# EAGLE design OpenROV Light Board 2.7A (EAGLE 6.4)
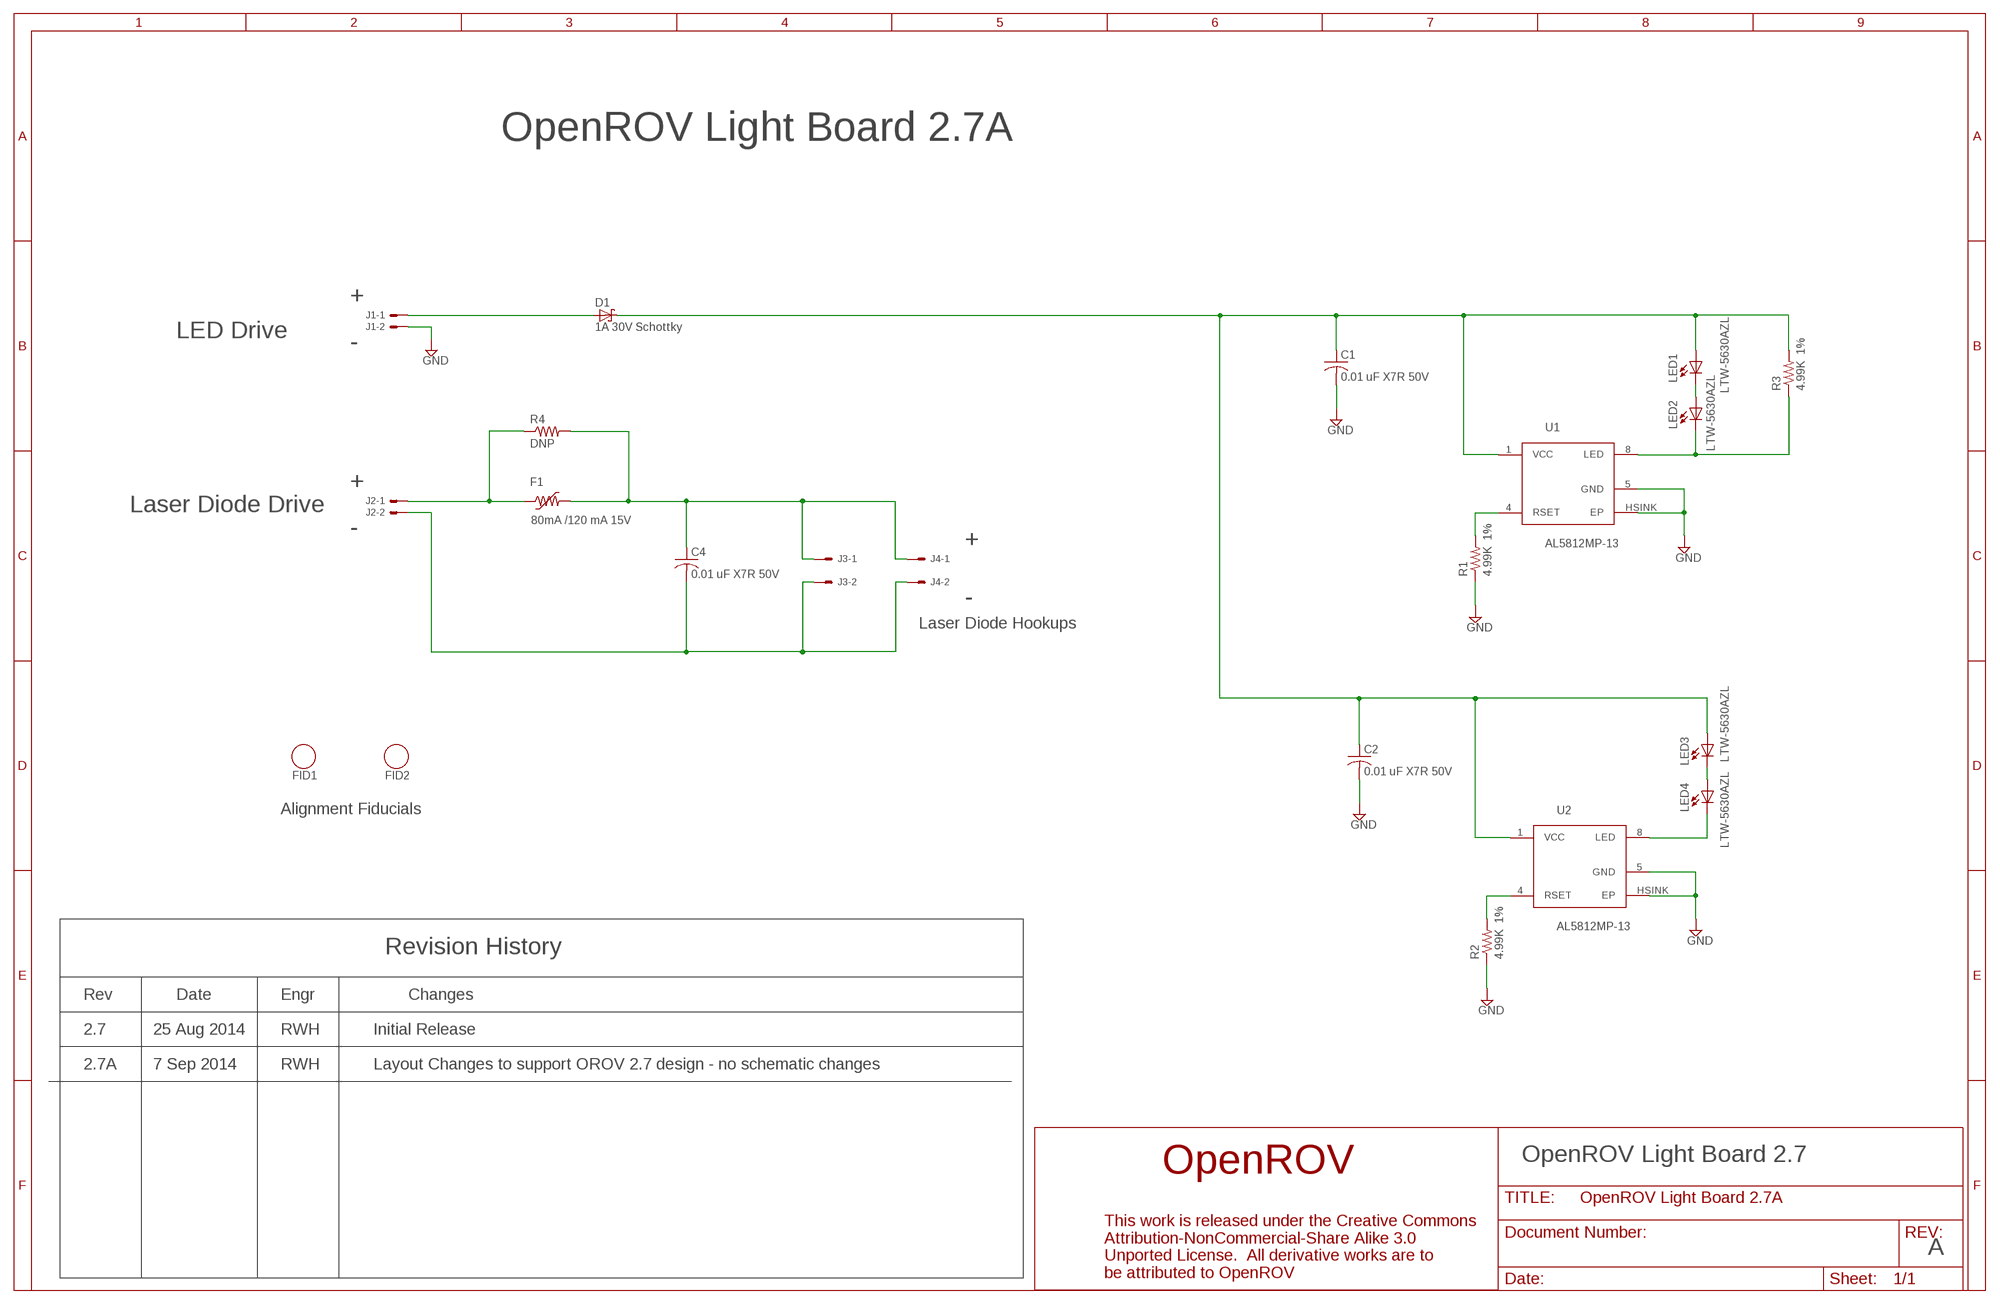
[diagram p0: schematic, sheet 1]

## Parts
C1  0.01 uF X7R 50V  CAP0603  [R0603]
C2  0.01 uF X7R 50V  CAP0603  [R0603]
C4  0.01 uF X7R 50V  CAP0603  [R0603]
D1  1A 30V Schottky  SCHOTTKYDO214AC  [DO214AC]
F1  80mA /120 mA 15V  POLYFUSE-0603  [R0603]
FID1  FIDUCIAL_1  [FIDUCIAL_1]
FID2  FIDUCIAL_1  [FIDUCIAL_1]
J1  HDR_1X2X0.100-ALT_SILK  [22-23-2021_ALT_SILK]
J2  HDR_1X2X0.100-ALT_SILK  [22-23-2021_ALT_SILK]
J3  HDR_1X2X2MM  [87758-0216]
J4  HDR_1X2X2MM  [87758-0216]
LED1  LTW-5630AZL  [LITEON-5630]
LED2  LTW-5630AZL  [LITEON-5630]
LED3  LTW-5630AZL  [LITEON-5630]
LED4  LTW-5630AZL  [LITEON-5630]
R1  4.99K 1%  RESISTOR-0603  [R0603]
R2  4.99K 1%  RESISTOR-0603  [R0603]
R3  4.99K 1%  RESISTOR-0603  [R0603]
R4  DNP  RESISTOR-1206  [R1206]
U1  AL5812MP-13  [MSOP-8EP]
U2  AL5812MP-13  [MSOP-8EP]

## Nets
GND: C1.2 C2.2 J1.2 R1.1 R2.1 U1.5(GND) U1.HSINK(EP) U2.5(GND) U2.HSINK(EP)
N$1: LED2.C1(C) LED2.C2(C) R3.1 U1.8(LED)
N$2: LED1.C1(C) LED1.C2(C) LED2.A1(A) LED2.A2(A) LED2.A3(A)
N$3: C4.1 F1.2 J3.1 J4.1 R4.2
N$4: C4.2 J2.2 J3.2 J4.2
N$5: F1.1 J2.1 R4.1
N$6: R1.2 U1.4(RSET)
N$7: LED4.C1(C) LED4.C2(C) U2.8(LED)
N$8: LED3.C1(C) LED3.C2(C) LED4.A1(A) LED4.A2(A) LED4.A3(A)
N$9: C1.1 C2.1 D1.C LED1.A1(A) LED1.A2(A) LED1.A3(A) LED3.A1(A) LED3.A2(A) LED3.A3(A) R3.2 U1.1(VCC) U2.1(VCC)
N$11: D1.A J1.1
N$13: R2.2 U2.4(RSET)

## Notes on the sheet
- OpenROV Light Board 2.7A
- +
- LED Drive
- -
- +
- Laser Diode Drive
- -
- +
- -
- Laser Diode Hookups
- Alignment Fiducials
- Revision History
- Rev | Date | Engr | Changes
- 2.7 | 25 Aug 2014 | RWH | Initial Release
- 2.7A | 7 Sep 2014 | RWH | Layout Changes to support OROV 2.7 design - no schematic changes
- OpenROV Light Board 2.7
- A

## Library data of the parts
C1 C2 C4 = Walts_Generic_Parts:CAP: Generic Non-Polarized Capacitor
D1 = Walts_Generic_Parts:SCHOTTKY: Silicon Schottky Diodes
F1 = Walts_Generic_Parts:POLYFUSE: Polyfuse / PPTC
FID1 FID2 = Walts Test Points and Pads:FIDUCIAL_1: Alignment Fiducial
J1 J2 = Walts Generic Connectors:HDR_1X2X0.100: .100" (2.54mm) Center Header - 2 Pin Derived from Molex 22-23-2021
J3 J4 = Walts Generic Connectors:HDR_1X2X2MM: Original Source: Eagle Lib con-molex/87758-0216 2 Pin - 2mm Dual Row Single Wafer, Vertical T/H HDR Source: http://www.molex.com/pdm_docs/sd/877580616_sd.pdf; MPN: 87758-0216; OC_FARNELL: unknown; OC_NEWARK: 94M1513
LED1-LED4 = OpenROV LED Library:LTW-5630AZL: Lite-On 5x3 mm LTW-5630AZL White LED
R1-R4 = Walts_Generic_Parts:RESISTOR: Generic Resistor
U1 U2 = OpenROV LED Library:AL5812: Diodes, Inc AL5812 LED Driver

## Board
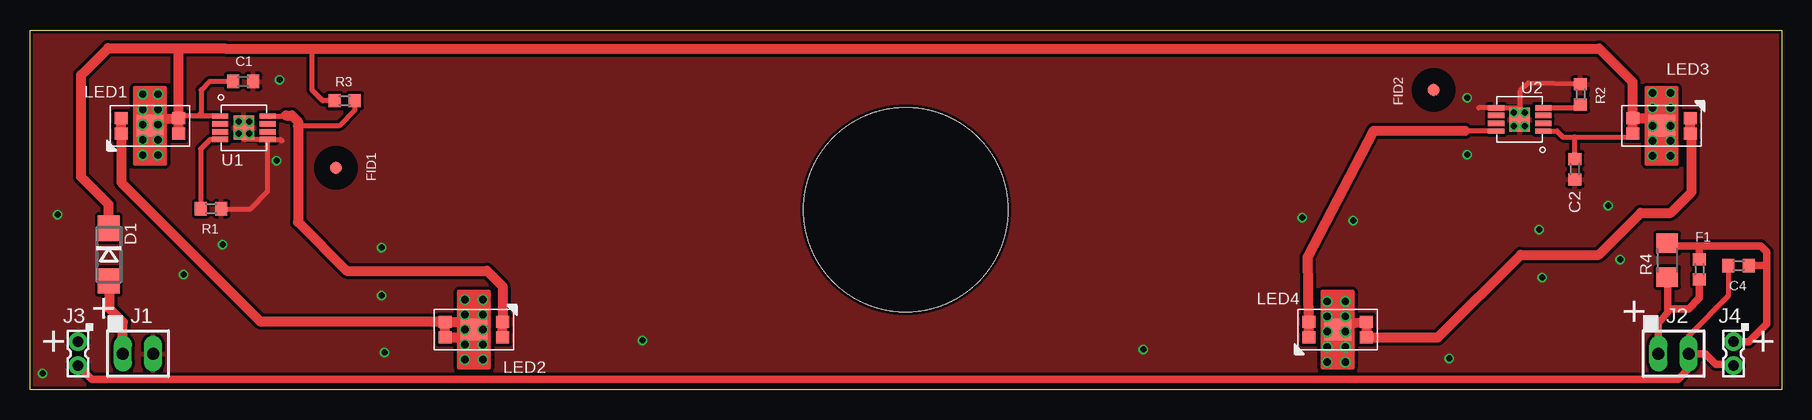
[diagram p1: board, top side]
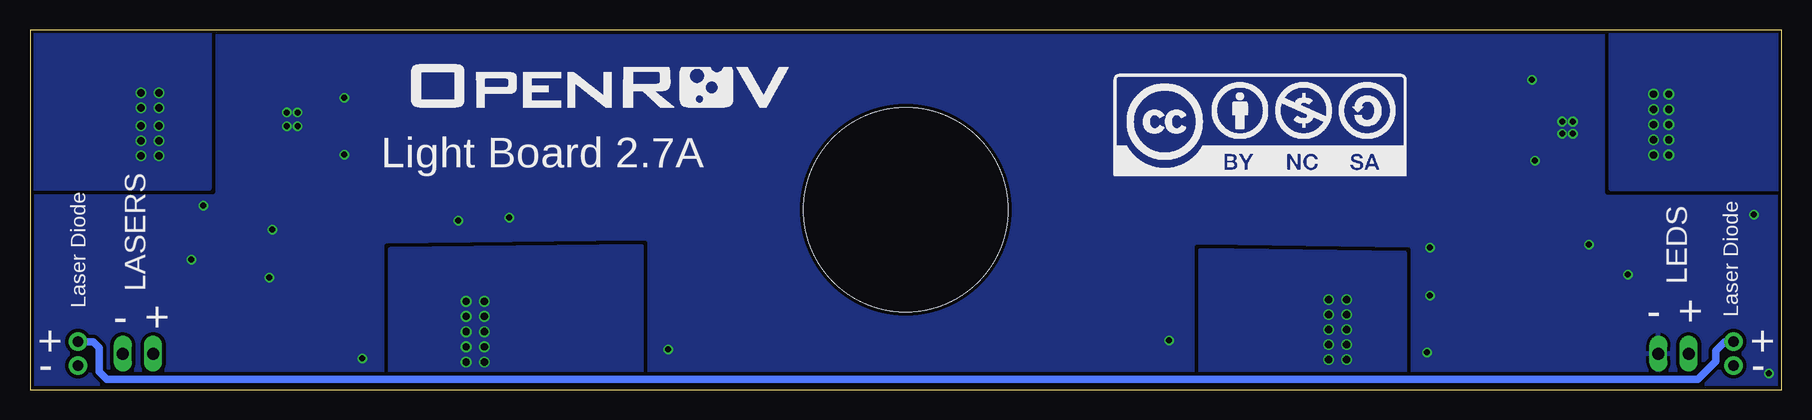
[diagram p2: board, bottom side, seen from below]

Size 146 x 30 mm. Coordinates in mm from the lower left corner, seen from the top.
Outline: 0,0 0,30 146,30 146,0 0,0
Copper layers (1*2*15*16): Top 0.035mm / dielectric 0.2mm / Route2 0.0175mm / dielectric 1.1mm / Route15 0.0175mm / dielectric 0.2mm / Bottom 0.035mm
Design rules "SeeedStudio_DRU_no_angle_20130527": minimum track width 6mil, minimum drill 12mil, track to track 6mil, track to pad 6mil, pad to pad 6mil, via to via 6mil, smd to smd 0mil, copper to edge 10mil, drill to drill 10mil, minimum pad ring 6mil, minimum via ring 6mil, stop-mask expansion 2mil, vias tented up to drill 25mil, thermal gap 10mil
Holes 17 mm at 73,15

### Footprints (pad centres in the part's own frame; a part is rotated, then mirrored left to right if it is on the bottom)
R0603 = smd 1 x 1.1: 1 -0.85,0; 2 0.85,0
DO214AC = smd 2.1 x 1.8: A 2.2,0; C -2.2,0
FIDUCIAL_1 = smd 1.016 x 1.016: P$1 0,0
22-23-2021_ALT_SILK = drill 1 long: 1 -1.27,0; 2 1.27,0
87758-0216 = drill 0.9 pad 1.524: 1 0,-1; 2 0,1
LITEON-5630 = smd 1.1 x 1: A1 2.4,-0.65; A2 2.4,0.65; C1 -2.4,-0.65; C2 -2.4,0.65 | smd 2.2 x 1.8: A3 0,0
R1206 = smd 1.6 x 1.803: 1 -1.422,0; 2 1.422,0
MSOP-8EP = smd 0.45 x 1.35: 1 -0.975,-1.975; 2 -0.325,-1.975; 3 0.325,-1.975; 4 0.975,-1.975; 5 0.975,1.975; 6 0.325,1.975; 7 -0.325,1.975; 8 -0.975,1.975 | smd 2 x 1.7: HSINK 0,0

### Placement (x,y rotation side)
C1  17.77,25.71 0 top
C2  128.77,18.39 270 top
C4  142.43,10.34 180 top
D1  6.56,11.25 270 top
F1  139.16,10.02 90 top
FID1  25.5,18.5 180 top
FID2  117,25 0 top
J1  9,3 0 top
J2  137,3 0 top
J3  4,3 180 top
J4  142,3 180 top
LED1  10,22 0 top
LED2  37,5 180 top
LED3  136,22 180 top
LED4  109,5 0 top
R1  15.09,15.08 180 top
R2  129.23,24.62 270 top
R3  26.23,24.1 180 top
R4  136.47,10.79 90 top
U1  17.83,21.84 270 top
U2  124.18,22.54 90 top
U$1  [CC-LOGO-1-TOP]  55.66,17.82 0 bottom
U$2  [OROV-LOGO-1.25]  98.43,25.4 0 bottom

### Tracks (layer width: path | path; a pad name or v marks a point on that pad's centre or on a via)
GND  (via drill 0.5)
  Top 0.406: R1.1 18.38,15.08 19.81,16.51 19.81,20.86 U1.5 | U1.HSINK 17.83,21.92 v17.4,22.35 | U1.5 17.87,20.86 v17.4,21.34 | v123.7,23.11 123.7,23.02 U2.HSINK | 124.19,23.51 U2.5 120.76,23.51 120.75,23.5 | 124.19,23.51 v124.59,23.11 | R2.1 124.89,25.57 124.21,24.89 124.21,23.53 124.19,23.51 | U1.5 20.89,20.86 21,20.75
  other vias: 18.29,22.35 18.29,21.34 124.59,21.97 123.7,21.97 119.8,19.59 20.8,25.84 118.3,2.58 126.05,9.34 131.55,15.34 92.8,3.33 51.05,4.08 29.55,3.08 106.05,14.34 29.3,11.84 29.3,7.83 2.3,14.59 119.8,24.34 132.55,10.84 125.8,13.34 110.3,14.09 16.05,12.09 12.8,9.59 1.05,1.33 20.55,19.09
  pour Bottom (isolate 0.305, rank 2): 0,0 0,30 146,30 146,0
  pour Top (isolate 0.254): 0,0 0,30 146,30 146,0
N$1
  Top 0.406: U1.8 21.29,22.82 21.34,22.86 | R3.1 27.08,23.33 25.75,22 22.35,22
  Top 0.813: 21.34,22.86 21.84,22.86 22.35,22.35 22.35,22 22.35,13.97 26.42,9.91 38.09,9.91 39.38,8.62 39.38,5.67 LED2.C1 LED2.C2
N$2  (via drill 0.6)
  Top 0.406: v36.25,6.25 36.25,5.75 36.62,5.38
  Top 0.813: LED1.C2 LED1.C1 7.62,21.33 7.62,17.27 19.24,5.65 LED2.A1 | LED2.A1 LED2.A2 36.9,4.35 37,4.25 | LED2.A1 36.35,5.65 36.62,5.38 LED2.A3
  other vias: 36.25,7.5 37.75,7.5 37.75,5 36.25,5 37.75,6.25 37.75,3.75 37.75,2.5 36.25,2.5 36.25,3.75
  pour Bottom (isolate 0.305): 31.32,11.43 48.51,11.68 48.51,0.76 31.32,0.51
N$3
  Top 0.61: J4.1 143.25,4 144.75,5.5 144.75,10.25 | 144.75,10.25 144.75,11.5 144.25,12 139,12 | 139,12 136.68,12 R4.2 | F1.2 139.16,11.84 139,12 | C4.1 144.66,10.34 144.75,10.25
  Bottom 0.61: J3.1 4.75,4 5.5,3.25 5.5,2.38 7,0.88 139.62,0.88 140.25,1.5 140.25,3.5 140.75,4 J4.1
N$4
  Top 0.406: C4.2 141.58,7.83 138.25,4.5 138.25,3.02 J2.2
  Top 0.61: J4.2 141.88,2.12 140.5,2.12 139.62,3 J2.2 138.27,1.77 137.38,0.88 5.12,0.88 J3.2
N$5
  Top 0.61: J2.1 135.73,5.48 136.5,6.5 136.5,6.75 | 136.5,6.75 136.5,9.33 R4.1 | F1.1 139.16,7.66 138.25,6.75 136.5,6.75
N$6
  Top 0.406: U1.4 15.02,20.86 14.22,20.07 14.22,15.17 R1.2
N$7
  Top 0.406: 119.63,21.59 122.18,21.59 U2.8
  Top 0.813: LED4.C1 LED4.C2 106.5,11.08 112.01,21.59 119.63,21.59
N$8  (via drill 0.6)
  Top 0.406: v109.65,4.83 109.32,5.16
  Top 0.813: LED4.A3 109.32,5.16 109.55,5.4 LED4.A2 LED4.A1 117.35,4.35 124.25,11.25 130.75,11.25 134.25,14.75 136.75,14.75 138.5,16.5 138.5,21.25 LED3.C2 LED3.C1
  other vias: 108.12,4.83 108.12,6.1 109.65,6.1 108.12,7.37 108.12,3.56 108.12,2.29 109.65,2.29 109.65,3.56 109.65,7.37
  pour Bottom (isolate 0.305): 95.02,11.93 116,11.68 116,-0.25 95.02,0
N$9  (via drill 0.6)
  Top 0.406: U1.1 14,22.82 | 14,22.82 12.56,22.82 LED1.A2 | U2.1 127.28,21.56 127.76,21.08 128.75,21.08 | v10.67,22.1 10.1,22.1 LED1.A3 | R3.2 24.4,24.1 23.5,25 23.5,28.43 23.75,28.44 | v135.25,22 LED3.A3 | C1.1 14.96,25.71 14.25,25 14.25,23.07 14,22.82 | 128.75,21.08 133.33,21.08 LED3.A2 | C2.1 128.77,21.06 128.75,21.08
  Top 0.813: LED1.A1 LED1.A2 | LED1.A3 10.32,22 10.92,22.61 12.36,22.61 LED1.A2 | 133.5,21.25 LED3.A2 LED3.A1 | LED3.A1 133.6,25.66 130.81,28.45 23.75,28.44 16.26,28.45 12.5,28.45 | LED3.A1 135.35,22.65 LED3.A3 | D1.C 6.56,15.44 4.25,17.75 4.25,26.25 6.5,28.5 6.55,28.45 12.5,28.45 | LED1.A2 12.4,28.35 12.5,28.45
  other vias: 9.4,22.1 9.4,23.37 10.67,23.37 10.67,24.64 9.4,24.64 9.4,20.83 10.67,20.83 10.67,19.56 9.4,19.56 135.25,24.75 136.75,24.75 136.75,22 136.75,23.5 135.25,23.5 136.75,20.75 136.75,19.5 135.25,20.75 135.25,19.5
  pour Bottom: 14.22,29.97 14.22,16.76 0.25,16.76 0.25,29.97
  pour Bottom: 131.06,29.72 131.06,16.76 145.8,16.76 145.8,29.72
N$11
  Top 0.813: J1.1 7.73,5.64 6.62,6.75 6.62,8.99 D1.A
N$13
  Top 0.406: U2.4 129.53,23.51 R2.2

### Text on the board
tPlace: + | + | + | +
bPlace: Light Board 2.7A | LEDS | LASERS | Laser Diode | Laser Diode | + | - | + | - | + | + | - | -